# EAGLE design lamloei_node32s3wroom_ft231xq_main_2layers (EAGLE 7.7.0)
CNAME: LamLoei Node32S3Wroom; CREVISION: R1; DESIGNER: lamloei co.,ltd.
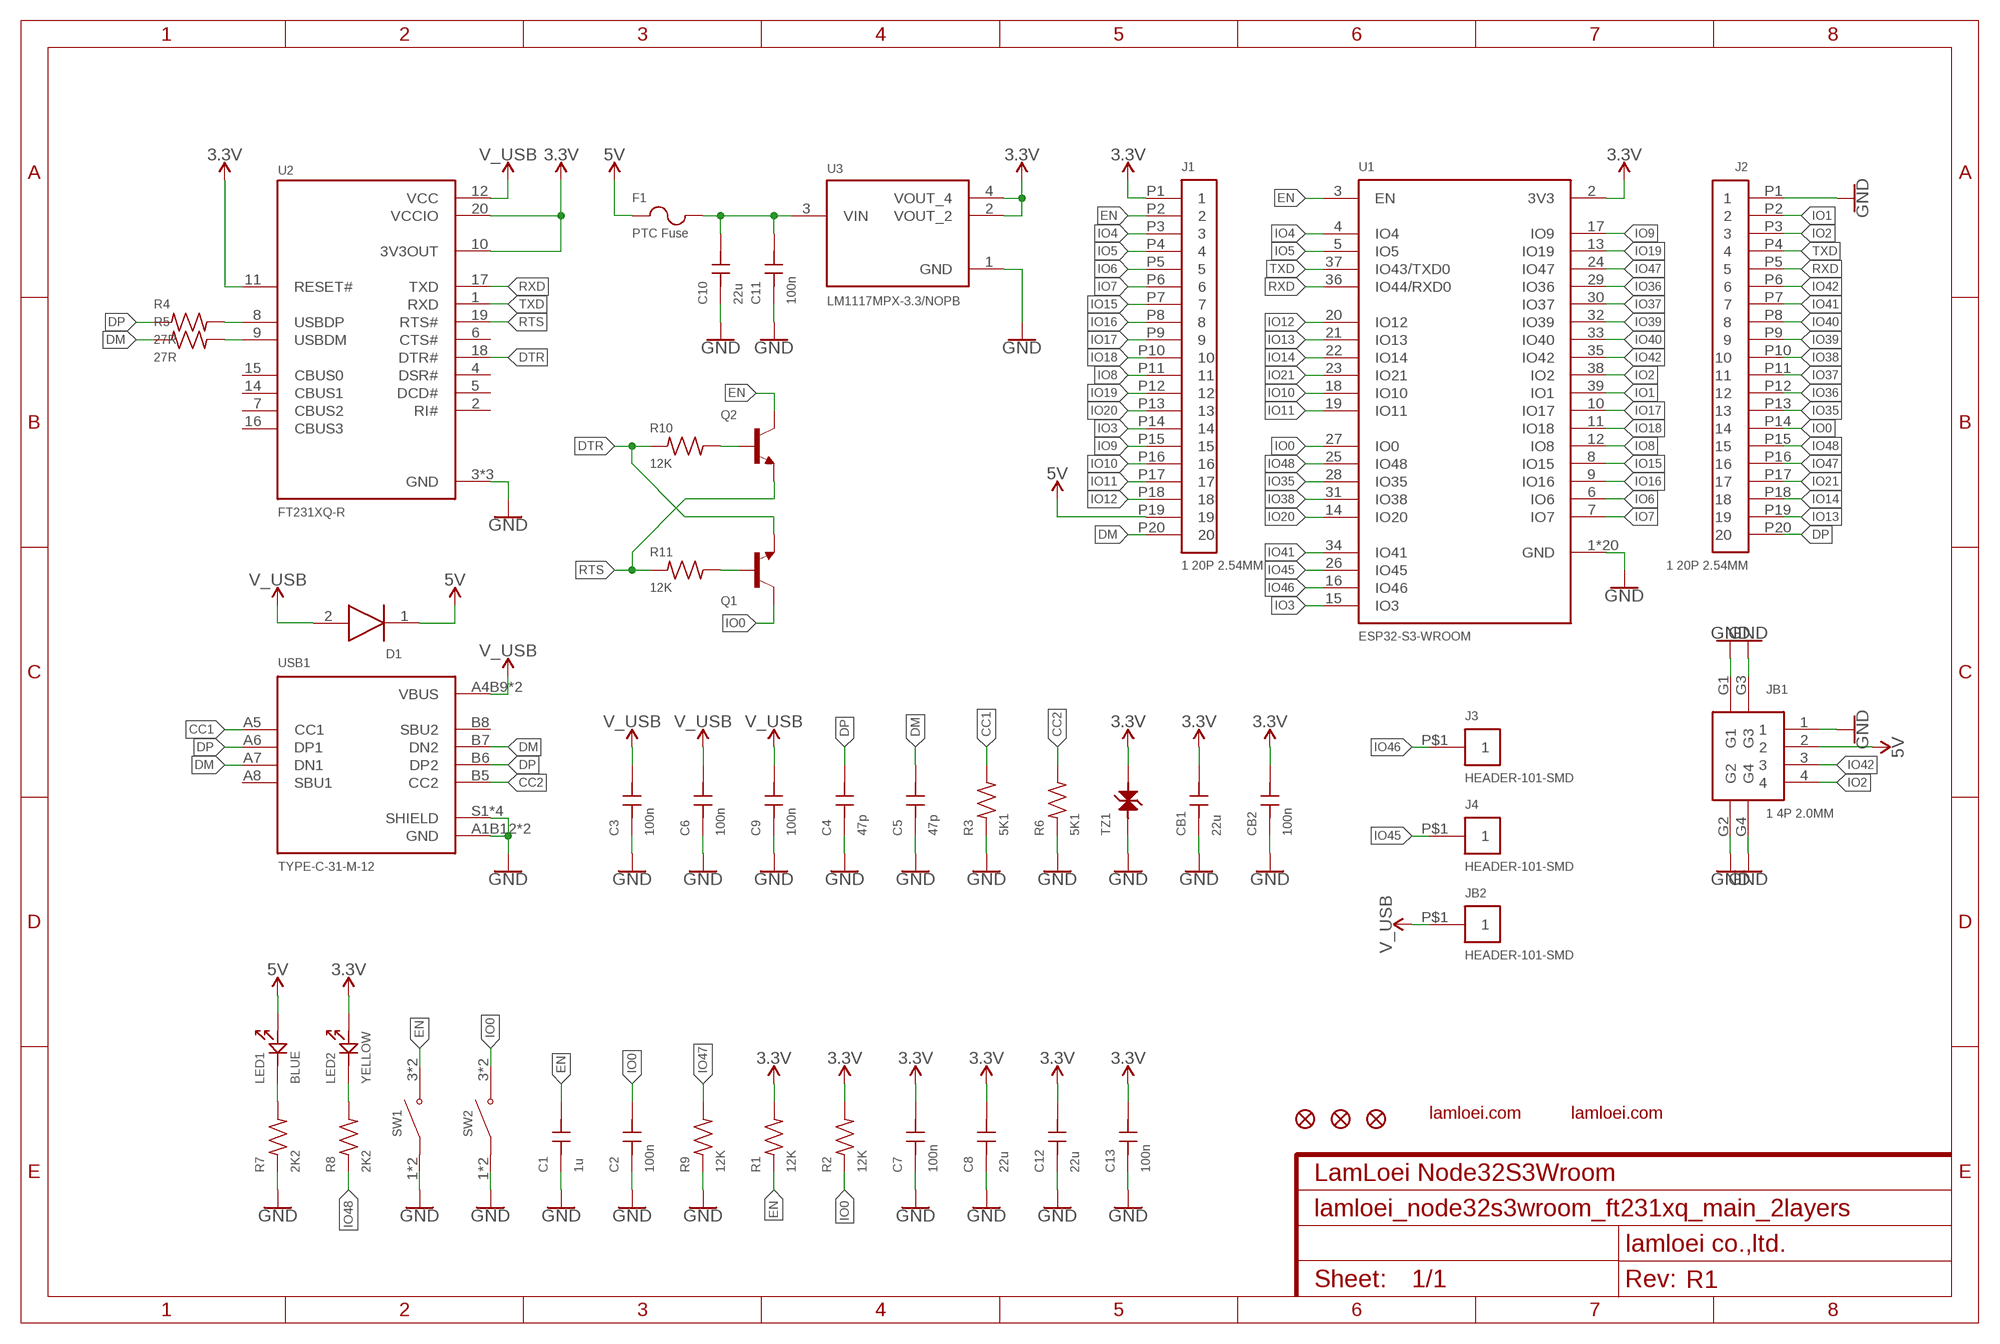
[diagram p0: schematic, sheet 1]

## Parts
C1  1u  GRM155R70J105KA12D  [GRM155R70J105KA12D]
C2  100n  GCM155R71H104KE02D  [GCM155R71H104KE02D]
C3  100n  GCM155R71H104KE02D  [GCM155R71H104KE02D]
C4  47p  GCM1555C1H470JA16D  [GCM1555C1H470JA16D]
C5  47p  GCM1555C1H470JA16D  [GCM1555C1H470JA16D]
C6  100n  GCM155R71H104KE02D  [GCM155R71H104KE02D]
C7  100n  GCM155R71H104KE02D  [GCM155R71H104KE02D]
C8  22u  GCM21BR71H105KA03L  [GCM21BR71H105KA03L]
C9  100n  GCM155R71H104KE02D  [GCM155R71H104KE02D]
C10  22u  GCM21BR71H105KA03L  [GCM21BR71H105KA03L]
C11  100n  GCM155R71H104KE02D  [GCM155R71H104KE02D]
C12  22u  GCM21BR71H105KA03L  [GCM21BR71H105KA03L]
C13  100n  GCM155R71H104KE02D  [GCM155R71H104KE02D]
CB1  22u  GCM21BR71H105KA03L  [GCM21BR71H105KA03L]
CB2  100n  GCM155R71H104KE02D  [GCM155R71H104KE02D]
D1  PMEG4050EP,115  [PMEG4050EP,115]
F1  PTC Fuse  MF-NSMF050-2  [MF-NSMF050-2]
J1  1 20P 2.54MM  HEADER-120  [HEADER-120]
J2  1 20P 2.54MM  HEADER-120  [HEADER-120]
J3  HEADER-101-SMD  [HEADER-101-SMD]
J4  HEADER-101-SMD  [HEADER-101-SMD]
JB1  1 4P 2.0MM  A2012WR-S-4P  [A2012WR-S-4P]
JB2  HEADER-101-SMD  [HEADER-101-SMD]
LED1  BLUE  19-217BHC-ZL1M2RY3T  [19-217BHC-ZL1M2RY3T]
LED2  YELLOW  19-213/Y2C-CQ2R2L/3T(CY)  [19-213/Y2C-CQ2R2L/3T(CY)]
Q1  BC847B,215  [BC847B,215]
Q2  BC847B,215  [BC847B,215]
R1  12K  RC0402FR-0712KL  [R0402]
R2  12K  RC0402FR-0712KL  [R0402]
R3  5K1  RC0402FR-075K1L  [R0402]
R4  27R  RC0402FR-0727RL  [R0402]
R5  27R  RC0402FR-0727RL  [R0402]
R6  5K1  RC0402FR-075K1L  [R0402]
R7  2K2  RC0402FR-072K2L  [R0402]
R8  2K2  RC0402FR-072K2L  [R0402]
R9  12K  RC0402FR-0712KL  [R0402]
R10  12K  RC0402FR-0712KL  [R0402]
R11  12K  RC0402FR-0712KL  [R0402]
SW1  K2-1808SN-A4SW-01  [K2-1808SN-A4SW-01]
SW2  K2-1808SN-A4SW-01  [K2-1808SN-A4SW-01]
TZ1  LXES15AAA1-153  [LXES15AAA1-153]
U1  ESP32-S3-WROOM  [ESP32-S3-WROOM]
U2  FT231XQ-R  [FT231XQ-R]
U3  LM1117MPX-3.3/NOPB  [LM1117MPX-3.3/NOPB]
USB1  TYPE-C-31-M-12  [TYPE-C-31-M-12]
ZFD1  FIDUCIAL1X2  [FIDUCIAL-1X2]
ZFD2  FIDUCIAL1X2  [FIDUCIAL-1X2]
ZFD3  FIDUCIAL1X2  [FIDUCIAL-1X2]
ZL1  LAMLEOI_LOGO_3  [LAMLEOI_LOGO_3]
ZL2  LAMLEOI_LOGO_3  [LAMLEOI_LOGO_3]

## Nets
3.3V: C7.2 C8.2 C12.2 C13.2 CB1.2 CB2.2 J1.P1 LED2.2 R1.2 R2.2 TZ1.2 U1.2(3V3) U2.10(3V3OUT) U2.11(RESET#) U2.20(VCCIO) U3.2(VOUT_2) U3.4(VOUT_4)
5V: D1.1(K) F1.1 J1.P19 JB1.2 LED1.2
CC1: R3.2 USB1.A5(CC1)
CC2: R6.2 USB1.B5(CC2)
DM: C5.2 J1.P20 R5.1 USB1.A7(DN1) USB1.B7(DN2)
DP: C4.2 J2.P20 R4.1 USB1.A6(DP1) USB1.B6(DP2)
DTR: Q1.E R10.1 U2.18(DTR#)
EN: C1.2 J1.P2 Q2.C R1.1 SW1.3(NO) SW1.4(NO) U1.3(EN)
GND: C1.1 C2.1 C3.1 C4.1 C5.1 C6.1 C7.1 C8.1 C9.1 C10.1 C11.1 C12.1 C13.1 CB1.1 CB2.1 J2.P1 JB1.1 JB1.G1 JB1.G2 JB1.G3 JB1.G4 R3.1 R6.1 R7.1 R9.1 SW1.1(COM) SW1.2(COM) SW2.1(COM) SW2.2(COM) TZ1.1 U1.1(GND) U1.1.1(GND) U1.1.2(GND) U1.1.3(GND) U1.1.4(GND) U1.1.5(GND) U1.1.6(GND) U1.1.7(GND) U1.1.8(GND) U1.1.9(GND) U1.1.10(GND) U1.1.11(GND) U1.1.12(GND) U1.1.13(GND) U1.1.14(GND) U1.1.15(GND) U1.1.16(GND) U1.1.17(GND) U1.1.18(GND) U1.40(GND) U2.3(GND) U2.13(GND) U2.21(GND) U3.1(GND) USB1.A1B12(GND) USB1.B1A12(GND) USB1.S1(SHIELD) USB1.S2(SHIELD) USB1.S3(SHIELD) USB1.S4(SHIELD)
IO0: C2.2 J2.P14 Q1.C R2.1 SW2.3(NO) SW2.4(NO) U1.27(IO0)
IO1: J2.P2 U1.39(IO1)
IO2: J2.P3 JB1.4 U1.38(IO2)
IO3: J1.P14 U1.15(IO3)
IO4: J1.P3 U1.4(IO4)
IO5: J1.P4 U1.5(IO5)
IO6: J1.P5 U1.6(IO6)
IO7: J1.P6 U1.7(IO7)
IO8: J1.P11 U1.12(IO8)
IO9: J1.P15 U1.17(IO9)
IO10: J1.P16 U1.18(IO10)
IO11: J1.P17 U1.19(IO11)
IO12: J1.P18 U1.20(IO12)
IO13: J2.P19 U1.21(IO13)
IO14: J2.P18 U1.22(IO14)
IO15: J1.P7 U1.8(IO15)
IO16: J1.P8 U1.9(IO16)
IO17: J1.P9 U1.10(IO17)
IO18: J1.P10 U1.11(IO18)
IO19: J1.P12 U1.13(IO19)
IO20: J1.P13 U1.14(IO20)
IO21: J2.P17 U1.23(IO21)
IO35: J2.P13 U1.28(IO35)
IO36: J2.P12 U1.29(IO36)
IO37: J2.P11 U1.30(IO37)
IO38: J2.P10 U1.31(IO38)
IO39: J2.P9 U1.32(IO39)
IO40: J2.P8 U1.33(IO40)
IO41: J2.P7 U1.34(IO41)
IO42: J2.P6 JB1.3 U1.35(IO42)
IO45: J4.P$1 U1.26(IO45)
IO46: J3.P$1 U1.16(IO46)
IO47: J2.P16 R9.2 U1.24(IO47)
IO48: J2.P15 R8.1 U1.25(IO48)
N$1: R4.2 U2.8(USBDP)
N$2: R5.2 U2.9(USBDM)
N$3: C10.2 C11.2 F1.2 U3.3(VIN)
N$4: LED1.1 R7.2
N$5: LED2.1 R8.2
N$6: Q2.B R10.2
N$7: Q1.B R11.2
RTS: Q2.E R11.1 U2.19(RTS#)
RXD: J2.P5 U1.36(IO44/RXD0) U2.17(TXD)
TXD: J2.P4 U1.37(IO43/TXD0) U2.1(RXD)
V_USB: C3.2 C6.2 C9.2 D1.2(A) JB2.P$1 U2.12(VCC) USB1.A4B9(VBUS) USB1.B4A9(VBUS)
Unconnected: U2.2(RI#) U2.4(DSR#) U2.5(DCD#) U2.6(CTS#) U2.7(CBUS2) U2.14(CBUS1) U2.15(CBUS0) U2.16(CBUS3) USB1.A8(SBU1) USB1.B8(SBU2)

## Library data of the parts
C1 = lamloei_e77_GRM155R70J105KA12D:GRM155R70J105KA12D; MANUFACTURER_PART_NUMBER: GRM155R70J105KA12D; VENDOR: Murata
C2 C3 C6 C7 C9 C11 C13 CB2 = lamloei_e77_GCM155R71H104KE02D:GCM155R71H104KE02D; MANUFACTURER_PART_NUMBER: GCM155R71H104KE02D; VENDOR: Murata
C4 C5 = lamloei_e77_GCM1555C1H470JA16D:GCM1555C1H470JA16D; MANUFACTURER_PART_NUMBER: GCM1555C1H470JA16D; VENDOR: Murata
C8 C10 C12 CB1 = lamloei_e77_GCM21BR71H105KA03L:GCM21BR71H105KA03L; MANUFACTURER_PART_NUMBER: GCM21BR71H105KA03L; VENDOR: Murata
D1 = lamloei_e77_PMEG4050EP_115:PMEG4050EP,115: Nexperia PMEG4050EP,115 SMT Schottky Diode, 40V 5A, 2-Pin SOD-128 Source: Datasheet <http://uk.rs-online.com/web/p/products/7805405P>; DESCRIPTION: Nexperia PMEG4050EP,115 SMT Schottky Diode, 40V 5A, 2-Pin SOD-128; HEIGHT: 1.1mm; MANUFACTURER_NAME: Nexperia; MANUFACTURER_PART_NUMBER: PMEG4050EP,115; RS_PART_NUMBER: 7805405P; RS_PRICE-STOCK: http://uk.rs-online.com/web/p/products/7805405P
F1 = lamloei_e77_mf-nsmf050-2:MF-NSMF050-2; DATASHEET: https://datasheet.lcsc.com/lcsc/1809212037_BOURNS-MF-NSMF050-2_C75464.pdf; DESCRIPTIONS: 13.2V 1A 1206 PTC Resettable Fuses; LCSC_PART: C75464; MANUFACTURER: BOURNS; MANUFACTURER_PART_NUMBER: MF-NSMF050-2; OPERATION_TEMPERATURE: -40°C ~ +85°C; OPERATION_TEMPERATURE_HIGH: +85°C; OPERATION_TEMPERATURE_LOW: -40°C; PACKAGE: 1206; PCBA_COST: Extended
J1 = lamloei_e77_HEADER-120A:HEADER-120
J2 = lamloei_e77_HEADER-120B:HEADER-120
J3 J4 JB2 = lamloei_e77_HEADER-101-SMD:HEADER-101-SMD
JB1 = lamloei_e77_a2012wr-s-4p:A2012WR-S-4P
LED1 = lamloei_e77_19-217BHC-ZL1M2RY3T:19-217BHC-ZL1M2RY3T; MANUFACTURER_PART_NUMBER: 19-217BHC-ZL1M2RY3T; VENDOR: Everlight Elec
LED2 = lamloei_e77_19-213Y2C-CQ2R2L3T(CY):19-213/Y2C-CQ2R2L/3T(CY); MANUFACTURER_PART_NUMBER: 19-213/Y2C-CQ2R2L/3T(CY); VENDOR: Everlight Elec
Q1 Q2 = lamloei_e77_bc847b_215:BC847B,215; AVAILABILITY: In Stock; DESCRIPTION: Bipolar (BJT) Transistor NPN 45V 100mA 100MHz 300mW Surface Mount SOT-23-3 (TO-236); MF: ON Semiconductor; MP: BC847BLT3G; PACKAGE: SOT-23-3 ON Semiconductor; PRICE: None
R1 R2 R9-R11 = lamloei_e77_rc0402fr-0712kl:RC0402FR-0712KL; DATASHEET: https://datasheet.lcsc.com/lcsc/1811081726_YAGEO-RC0402FR-0712KL_C114760.pdf; DESCRIPTIONS: 12kΩ ±1% 0.0625W ±100ppm/°C; DIELECTRIC: X7R; LCSC_PART: C114760; MANUFACTURER: YAGEO; MANUFACTURER_PART_NUMBER: RC0402FR-0712KL; OPERATION_POWER: 1/16W; OPERATION_TEMPERATURE: -55°C ~ +155°C; OPERATION_TEMPERATURE_HIGH: +155°C; OPERATION_TEMPERATURE_LOW: -55°C; PACKAGE: 0402; PCBA_COST: EXTENDED; RATED_VOLTAGE: 100VDC; RESISTANCE: 12kΩ; TOLERANCE: ±1%
R3 R6 = lamloei_e77_rc0402fr-075k1l:RC0402FR-075K1L; DATASHEET: https://datasheet.lcsc.com/lcsc/1809201112_YAGEO-RC0402FR-075K1L_C105872.pdf; DESCRIPTIONS: 5.1kΩ ±1% 0.0625W ±100ppm/°C; DIELECTRIC: X7R; LCSC_PART: C105872; MANUFACTURER: YAGEO; MANUFACTURER_PART_NUMBER: RC0402FR-075K1L; OPERATION_POWER: 1/16W; OPERATION_TEMPERATURE: -55°C ~ +155°C; OPERATION_TEMPERATURE_HIGH: +155°C; OPERATION_TEMPERATURE_LOW: -55°C; PACKAGE: 0402; PCBA_COST: EXTENDED; RATED_VOLTAGE: 100VDC; RESISTANCE: 5.1kΩ; TOLERANCE: ±1%
R4 R5 = lamloei_e77_rc0402fr-0727rl:RC0402FR-0727RL; DATASHEET: https://datasheet.lcsc.com/lcsc/1810241334_YAGEO-RC0402FR-0727RL_C138021.pdf; DESCRIPTIONS: 27Ω ±1% 0.0625W ±100ppm/°C; DIELECTRIC: X7R; LCSC_PART: C138021; MANUFACTURER: YAGEO; MANUFACTURER_PART_NUMBER: RC0402FR-0727RL; OPERATION_POWER: 1/16W; OPERATION_TEMPERATURE: -55°C ~ +155°C; OPERATION_TEMPERATURE_HIGH: +155°C; OPERATION_TEMPERATURE_LOW: -55°C; PACKAGE: 0402; PCBA_COST: EXTENDED; RATED_VOLTAGE: 100VDC; RESISTANCE: 27Ω; TOLERANCE: ±1%
R7 R8 = lamloei_e77_rc0402fr-072k2l:RC0402FR-072K2L; DATASHEET: https://datasheet.lcsc.com/lcsc/1809201112_YAGEO-RC0402FR-072K2L_C114762.pdf; DESCRIPTIONS: 2.2kΩ ±1% 0.0625W ±100ppm/°C; DIELECTRIC: X7R; LCSC_PART: C114762; MANUFACTURER: YAGEO; MANUFACTURER_PART_NUMBER: RC0402FR-072K2L; OPERATION_POWER: 1/16W; OPERATION_TEMPERATURE: -55°C ~ +155°C; OPERATION_TEMPERATURE_HIGH: +155°C; OPERATION_TEMPERATURE_LOW: -55°C; PACKAGE: 0402; PCBA_COST: EXTENDED; RATED_VOLTAGE: 100VDC; RESISTANCE: 2.2kΩ; TOLERANCE: ±1%
SW1 SW2 = lamloei_e77_K2-1808SN-A4SW-01:K2-1808SN-A4SW-01: Check prices <https://pricing.snapeda.com/parts/4-1437565-2/TE%20Connectivity/view-part?ref=eda>; AVAILABILITY: In Stock; COMMENT: 4-1437565-2; CONFIGURATION_POLE-THROW: Single Pole - Single Throw; CONTACT_CURRENT_RATING: 50 mA; DESCRIPTION: Tactile Switch SPST-NO Top Actuated Surface Mount; EU_ROHS_COMPLIANCE: Compliant; MF: TE Connectivity; MP: 4-1437565-2; PACKAGE: None; PRICE: None
TZ1 = lamloei_e77_lxes15aaa1-153:LXES15AAA1-153; DATASHEET: https://datasheet.lcsc.com/lcsc/1811081617_Murata-Electronics-LXES15AAA1-153_C86141.pdf; DESCRIPTIONS: Bidirectional 4V 0402 Diodes - ESD; LCSC_PART: C86141; MANUFACTURER: Murata; MANUFACTURER_PART_NUMBER: LXES15AAA1-153; OPERATION_TEMPERATURE: -40°C ~ +85°C; OPERATION_TEMPERATURE_HIGH: +85°C; OPERATION_TEMPERATURE_LOW: -40°C; PACKAGE: 0402; PCBA_COST: EXTENDED; RATED_VOLTAGE: 4V
U1 = lamloei_e77_ESP32-S3-WROOM-ANT:ESP32-S3-WROOM: Module: combo; GPIO, I2C x2, I2S x2, SDIO, SPI x3, UART x3; 19.5dBm; AVAILABILITY: Warning; DESCRIPTION: Module: combo; GPIO, I2C x2, I2S x2, SDIO, SPI x3, UART x3; 19.5dBm; MF: Olimex LTD; MP: ESP-WROOM-32; PACKAGE: Module Espressif Systems; PRICE: 4.57 USD
U2 = lamloei_e77_FT231XQ-R:FT231XQ-R: USB2.0 Full Speed IC offers a compact bridge to full handshake UART Interface Check prices <https://pricing.snapeda.com/parts/FT231XQ-R/FTDI%2C%20Future/view-part?ref=eda>; AVAILABILITY: In Stock; DESCRIPTION: USB Bridge, USB to UART USB 2.0 UART Interface 20-QFN (4x4); MF: FTDI, Future; MP: FT231XQ-R; PACKAGE: QFN-20 FTDI; PRICE: None; PURCHASE-URL: https://pricing.snapeda.com/search/part/FT231XQ-R/?ref=eda
U3 = lamloei_e77_LM1117MPX-3.3_NOPB:LM1117MPX-3.3/NOPB: 800-mA 15-V linear voltage regulator 4-SOT-223 0 to 125 Check prices <https://pricing.snapeda.com/parts/LM1117MPX-3.3/NOPB/Texas%20Instruments/view-part?ref=eda>; AVAILABILITY: In Stock; DESCRIPTION: 800-mA 15-V linear voltage regulator 4-SOT-223 0 to 125; MF: Texas Instruments; MP: LM1117MPX-3.3/NOPB; PACKAGE: SOT-223-4 Texas Instruments; PRICE: None; PURCHASE-URL: https://pricing.snapeda.com/search/part/LM1117MPX-3.3/NOPB/?ref=eda
USB1 = _lamloei_e77_TYPE-C-31-M-12:TYPE-C-31-M-12; AVAILABILITY: Unavailable; DESCRIPTION: USB Connectors 24 Receptacle 1 8.94*7.3mm RoHS; DIFFX: 1.75; DIFFY: -3.53; MF: HRO Electronics Co., Ltd.; MP: TYPE-C-31-M-12; PACKAGE: Package; PRICE: None
ZFD1-ZFD3 = SparkFun-Aesthetics:FIDUCIAL: Fiducial Alignment Points Point-of-reference for pick-and-place machines and other optical instruments.
ZL1 ZL2 = lamloei_logo_3:LAMLEOI_LOGO_3: lamloei

## Board
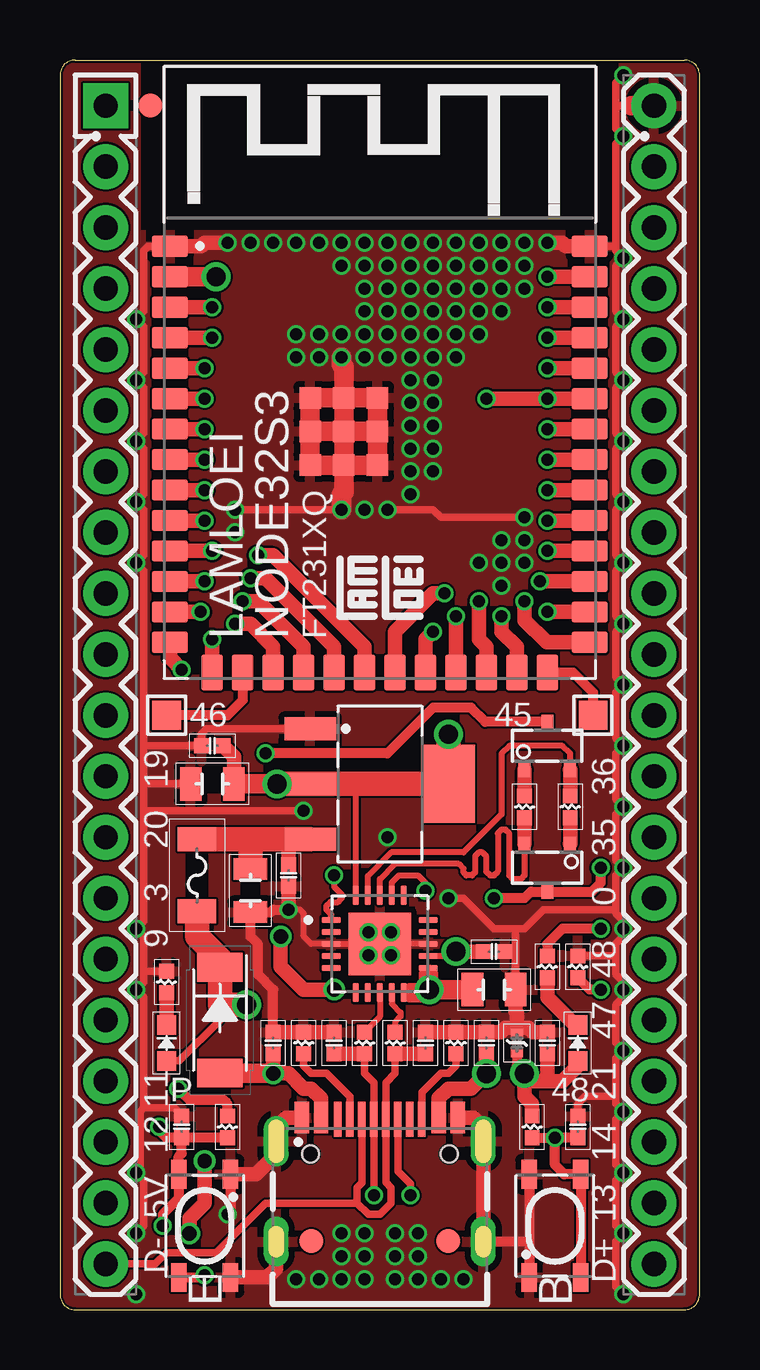
[diagram p1: board, top side]
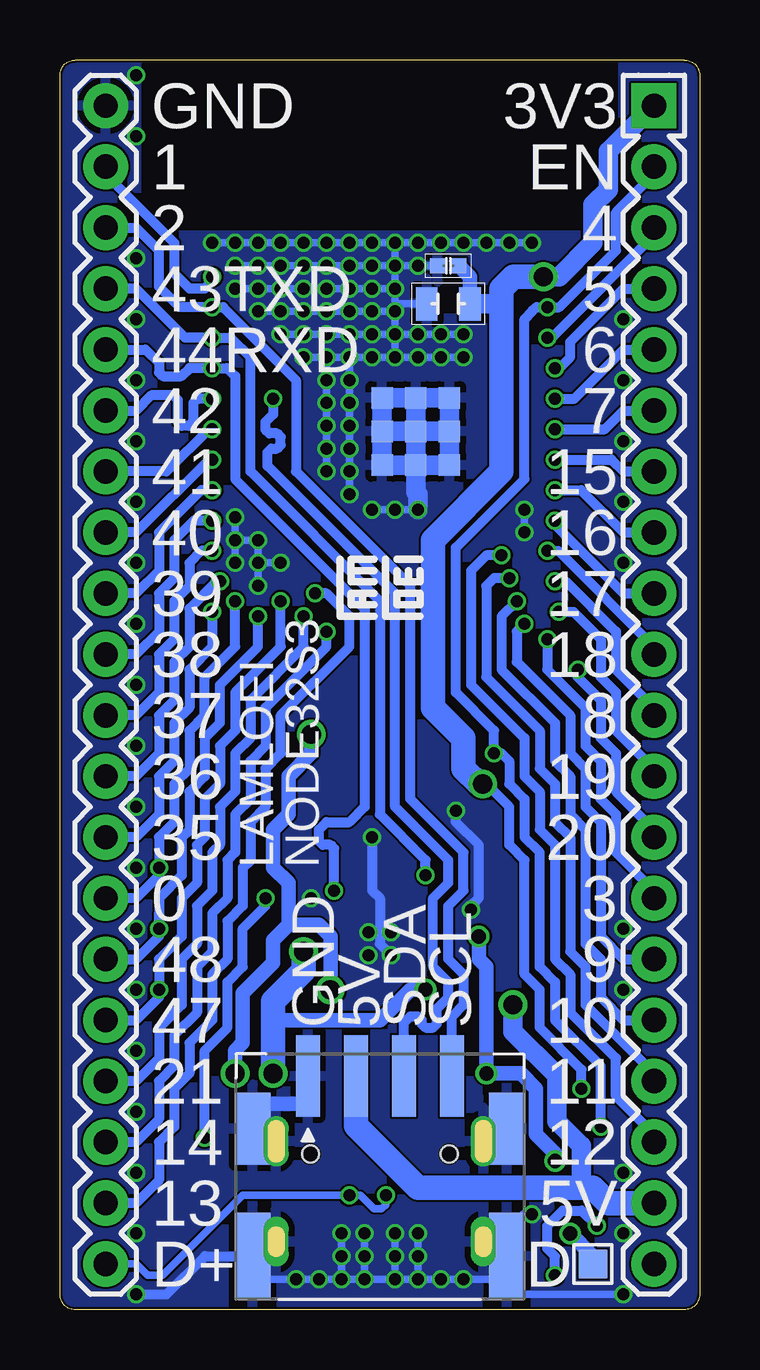
[diagram p2: board, bottom side, seen from below]

Size 26.67 x 52.07 mm. Coordinates in mm from the lower left corner, seen from the top.
Outline: 26.04,0 arc90 26.67,0.64 26.67,51.44 arc90 26.04,52.07 0.64,52.07 arc90 0,51.44 0,0.64 arc90 0.64,0 26.04,0
Copper layers (1*16): Top 0.035mm / dielectric 0.2mm / Bottom 0.035mm
Design rules "jlcpcb-2-layer": minimum track width 3.5mil, minimum drill 0.2mm, track to track 3.5mil, track to pad 5mil, pad to pad 5mil, via to via 5mil, smd to smd 0mil, copper to edge 0.1mm, drill to drill 5mil, minimum pad ring 4mil, minimum via ring 4mil, stop-mask expansion 3mil, vias tented up to drill 100mil, thermal gap 10mil

### Footprints (pad centres in the part's own frame; a part is rotated, then mirrored left to right if it is on the bottom)
GRM155R70J105KA12D = smd 0.62 x 0.62: 1 -0.45,0; 2 0.45,0
GCM155R71H104KE02D = smd 0.62 x 0.62: 1 -0.45,0; 2 0.45,0
GCM1555C1H470JA16D = smd 0.62 x 0.62: 1 -0.45,0; 2 0.45,0
GCM21BR71H105KA03L = smd 0.9 x 1.4: 1 -0.9,0; 2 0.9,0
PMEG4050EP,115 = smd 1.2 x 1.9: 1 -2.2,0; 2 2.2,0
MF-NSMF050-2 = smd 1 x 1.6: 1 -1.5,0; 2 1.5,0
HEADER-120 = drill 1.016 pad 1.88 square: P1 24.13,0 | drill 1.016 pad 1.88: P2 21.59,0; P3 19.05,0; P4 16.51,0; P5 13.97,0; P6 11.43,0; P7 8.89,0; P8 6.35,0; P9 3.81,0; P10 1.27,0; P11 -1.27,0; P12 -3.81,0; P13 -6.35,0; P14 -8.89,0; P15 -11.43,0; P16 -13.97,0; P17 -16.51,0; P18 -19.05,0; P19 -21.59,0; P20 -24.13,0
HEADER-120' = drill 1.016 pad 1.88: P1 24.13,0; P2 21.59,0; P3 19.05,0; P4 16.51,0; P5 13.97,0; P6 11.43,0; P7 8.89,0; P8 6.35,0; P9 3.81,0; P10 1.27,0; P11 -1.27,0; P12 -3.81,0; P13 -6.35,0; P14 -8.89,0; P15 -11.43,0; P16 -13.97,0; P17 -16.51,0; P18 -19.05,0; P19 -21.59,0; P20 -24.13,0
HEADER-101-SMD = smd 1.2 x 1.2: P$1 0,0
A2012WR-S-4P = smd 1 x 3.4: 1 -3,3.7; 2 -1,3.7; 3 1,3.7; 4 3,3.7 | smd 1.5 x 3.6: G1 -5.3,-3.8; G2 5.3,-3.8 | smd 1.5 x 3: G3 -5.3,1.5; G4 5.3,1.5
19-217BHC-ZL1M2RY3T = smd 0.8 x 0.8: 1 -0.75,0; 2 0.75,0
19-213/Y2C-CQ2R2L/3T(CY) = smd 0.8 x 0.8: 1 -0.75,0; 2 0.75,0
BC847B,215 = smd 0.6 x 0.5: B 1,-0.95; C -1,0; E 1,0.95
R0402 = smd 0.62 x 0.62: 1 -0.45,0; 2 0.45,0
K2-1808SN-A4SW-01 = smd 1.2 x 0.65: 1 -2.15,1.075; 2 2.15,1.075; 3 -2.15,-1.075; 4 2.15,-1.075
LXES15AAA1-153 = smd 0.4 x 0.5: 1 -0.4,0; 2 0.4,0
ESP32-S3-WROOM = smd 0.9 x 1.5: 1 -5.26,-8.75; 2 -3.99,-8.75; 3 -2.72,-8.75; 4 -1.45,-8.75; 5 -0.18,-8.75; 6 1.09,-8.75; 7 2.36,-8.75; 8 3.63,-8.75; 9 4.9,-8.75; 10 6.17,-8.75; 11 7.44,-8.75; 12 8.71,-8.75; 13 9.98,-8.75; 14 11.25,-8.75; 27 11.25,8.75; 28 9.98,8.75; 29 8.71,8.75; 30 7.44,8.75; 31 6.17,8.75; 32 4.9,8.75; 33 3.63,8.75; 34 2.36,8.75; 35 1.09,8.75; 36 -0.18,8.75; 37 -1.45,8.75; 38 -2.72,8.75; 39 -3.99,8.75; 40 -5.26,8.75 | smd 0.9 x 0.9: 1.1 1.06,-2.9; 1.2 1.06,-1.5; 1.3 1.06,-0.1; 1.4 2.46,-2.9; 1.5 2.46,-1.5; 1.6 2.46,-0.1; 1.7 3.86,-2.9; 1.8 3.86,-1.5; 1.9 3.86,-0.1 | smd 0.9 x 0.9 bottom: 1.10 1.06,-2.9; 1.11 1.06,-1.5; 1.12 1.06,-0.1; 1.13 2.46,-2.9; 1.14 2.46,-1.5; 1.15 2.46,-0.1; 1.16 3.86,-2.9; 1.17 3.86,-1.5; 1.18 3.86,-0.1 | smd 1.5 x 0.9: 15 12.5,-6.985; 16 12.5,-5.715; 17 12.5,-4.445; 18 12.5,-3.175; 19 12.5,-1.905; 20 12.5,-0.635; 21 12.5,0.635; 22 12.5,1.905; 23 12.5,3.175; 24 12.5,4.445; 25 12.5,5.715; 26 12.5,6.985
FT231XQ-R = smd 0.25 x 0.8: 1 -1,-2.025; 2 -0.5,-2.025; 3 0,-2.025; 4 0.5,-2.025; 5 1,-2.025; 11 1,2.025; 12 0.5,2.025; 13 0,2.025; 14 -0.5,2.025; 15 -1,2.025 | smd 0.8 x 0.25: 6 2.025,-1; 7 2.025,-0.5; 8 2.025,0; 9 2.025,0.5; 10 2.025,1; 16 -2.025,1; 17 -2.025,0.5; 18 -2.025,0; 19 -2.025,-0.5; 20 -2.025,-1 | smd 2.6 x 2.6: 21 0,0
LM1117MPX-3.3/NOPB = smd 2.15 x 0.95: 1 2.9,-2.3; 2 2.9,0; 3 2.9,2.3 | smd 2.15 x 3.25: 4 -2.9,0
TYPE-C-31-M-12 = smd 0.6 x 1.3: A1B12 3.25,-3.56; A4B9 2.45,-3.56; B1A12 -3.25,-3.56; B4A9 -2.45,-3.56 | smd 0.3 x 1.45: A5 1.25,-3.485; A6 0.25,-3.485; A7 -0.25,-3.485; A8 -1.25,-3.485; B5 -1.75,-3.485; B6 -0.75,-3.485; B7 0.75,-3.485; B8 1.75,-3.485 | drill 0.65 pad 1.05 long: S1 4.32,-2.57; S2 -4.32,-2.57; S3 4.32,1.61; S4 -4.32,1.61 | hole 0.7: 2.89,-2.04; -2.89,-2.04
FIDUCIAL-1X2 = smd 1 x 1: 1 0,0

### Placement (x,y rotation side)
C1  5.08,7.62 270 top
C2  21.59,7.62 270 top
C3  8.89,11.11 270 top
C4  11.43,11.11 270 top
C5  15.24,11.11 270 top
C6  17.78,11.11 270 top
C7  20.32,11.11 270 top
C8  18.1,13.34 180 top
C9  18.1,14.92 180 top
C10  7.94,17.46 90 top
C11  9.53,18.1 90 top
C12  6.35,21.91 0 top
C13  6.35,23.5 0 top
CB1  10.48,41.91 0 bottom
CB2  10.48,43.5 0 bottom
D1  6.67,12.06 270 top
F1  5.71,18.1 90 top
J1  1.91,26.04 90 top
J2  1 20P 2.54MM  [HEADER-120']  24.77,26.04 90 top
J3  4.45,24.77 0 top
J4  22.23,24.77 0 top
JB1  13.34,6.03 0 bottom
JB2  4.45,1.91 0 bottom
LED1  4.45,11.11 270 top
LED2  21.59,11.11 270 top
Q1  20.32,18.41 90 top
Q2  20.32,23.5 270 top
R1  6.99,7.62 90 top
R2  19.68,7.62 90 top
R3  10.16,11.11 270 top
R4  12.7,11.11 90 top
R5  13.97,11.11 90 top
R6  16.51,11.11 270 top
R7  4.45,13.65 270 top
R8  20.32,14.29 270 top
R9  21.59,14.29 270 top
R10  19.37,20.95 90 top
R11  21.27,20.95 270 top
SW1  6.03,3.49 270 top
SW2  20.64,3.49 90 top
TZ1  19.05,11.11 270 top
U1  13.34,39.05 270 top
U2  13.34,15.24 270 top
U3  13.34,21.91 180 top
USB1  13.34,4.45 180 top
ZFD1  3.77,50.16 0 top
ZFD2  10.48,2.86 0 top
ZFD3  16.19,2.86 0 top
ZL1  11.35,28.57 0 top
ZL2  15.32,28.57 0 bottom

### Tracks (layer width: path | path; a pad name or v marks a point on that pad's centre or on a via)
3.3V  (via drill 0.5, 0.8)
  Top 0.254: U2.10 14.61,13.21 | U2.11 15.36,13.97 | U2.20 12.34,21.91 12.38,21.91
  Top 0.406: TZ1.2 19.05,10.16 v19.37,9.84 | R1.2 6.99,8.57 6.83,8.73 5.4,8.73 v4.92,9.21
  Top 0.61: 16.83,13.34 C8.2 | R2.2 19.68,8.57 19.37,8.89 v19.37,9.84 19.37,9.53 20.32,9.53 | LED2.2 21.59,10.16 20.95,9.53 20.32,9.53 | C7.2 20.32,9.53 | C12.2 7.25,23.05 C13.2
  Top 0.813: 15.36,13.97 15.36,13.34 v15.4,13.34 | v15.4,13.34 16.83,13.34 | U1.2 v6.51,43.04 | C12.2 v9.05,21.91 | 14.61,13.21 15.28,13.21 v15.4,13.34
  Top 1.016: v16.19,23.97 16.19,21.91 U3.4 12.38,21.91 U3.2 v9.05,21.91
  Bottom 0.406: v4.92,9.21 4.92,10 6.67,11.75 6.67,13.34 7.3,13.97 7.3,18.73 7.94,19.37 7.94,20.95 8.89,21.91 v9.05,21.91
  Bottom 0.61: v15.4,13.34 15.4,15.56 15.88,16.03 17.14,16.03 | 17.14,16.03 17.78,15.4 17.78,14.45 19.05,13.18 19.05,11.11 19.37,10.79 v19.37,9.84 | 17.14,16.03 17.14,17.78 17.78,18.41 17.78,20 17.14,20.64 17.14,22.23 16.19,23.18 v16.19,23.97 | CB1.2 9.58,43.05 CB2.2
  Bottom 0.813: v6.51,43.04 5.85,43.04 4.45,44.45 4.45,46.04 3.81,46.67 3.81,48.26 J1.P1 | CB1.2 8.26,41.91
  Bottom 1.016: v6.51,43.04 7.76,43.04 8.26,42.55 8.26,41.91 8.26,34.92 11.11,32.07 11.11,25.08 9.84,23.81 9.84,22.54 9.21,21.91 v9.05,21.91
5V  (via drill 0.8)
  Top 0.305: LED1.2 4.96,10.36 6.67,12.06 6.67,12.7
  Top 1.016: F1.1 5.71,15.56 6.67,14.61 D1.1 6.67,12.7 v7.78,12.7
  Bottom 0.813: v7.78,12.7 7.78,11.59 5.95,9.76 5.95,7.86 4.92,6.83 4.92,5.08
  Bottom 1.016: J1.P19 3.81,4.45 4.45,5.08 4.92,5.08 11.75,5.08 14.34,7.67 JB1.2
CC1
  Top 0.305: USB1.A5 12.09,8.87 11.11,9.84 10.48,9.84 10.16,10.16 R3.2
CC2
  Top 0.305: USB1.B5 15.09,9.05 15.88,9.84 16.19,9.84 16.51,10.16 R6.2
DM
  Top 0.305: R5.1 13.97,9.84 13.59,9.46 USB1.A7 13.59,5.31 13.81,5.08 13.81,4.45 13.34,3.97 12.86,3.97 12.38,4.45 | J1.P20 3.97,1.91 4.45,2.38 6.51,2.38 8.57,4.45 12.38,4.45 | USB1.B7 12.59,5.28 12.38,5.08 12.38,4.45
  Top 0.61: R5.1 C5.2
DP  (via drill 0.5)
  Top 0.305: R4.1 12.7,9.84 13.09,9.46 USB1.A6 v13.09,4.76 | USB1.B6 14.09,5.76 14.61,5.24 v14.61,4.76
  Top 0.61: C4.2 R4.1
  Bottom 0.305: J2.P20 23.5,1.91 23.02,1.43 22.38,1.43 19.05,4.76 v14.61,4.76 14.13,4.76 13.57,4.21 13.26,4.21 13.09,4.38 v13.09,4.76
DTR
  Top 0.254: U2.18 13.34,17.94 13.97,18.57 16.63,18.57 16.83,18.38 16.83,18.22 16.95,18.1 17.18,18.1 17.3,18.22 17.3,18.89 17.46,19.05 17.62,19.05 17.78,18.89 17.78,18.26 17.94,18.1 18.1,18.1 18.26,18.26 18.26,19.84 18.41,20 18.57,20 18.73,19.84 18.73,18.1 18.89,17.94 19.21,17.94 19.37,18.1 Q1.E
  Top 0.61: R10.1 | Q1.E R10.1
EN  (via drill 0.5)
  Top 0.406: Q2.C 17.73,24.5 17.14,25.08 15.56,25.08 13.65,23.18 v8.57,23.18 | R1.1 C1.2 | C1.2 5.08,6.51 4.96,6.39 SW1.3 4.96,4.64 4.29,3.97 v4.29,3.49 | C1.2 4.42,7.17 4.13,7.46 v4.13,7.62 | SW1.4 5.95,1.34 v6.03,1.43
  Top 0.61: U1.3 v6.35,41.77
  Bottom 0.406: J1.P2 1.91,47.31 3.49,45.72 3.49,44.13 5.85,41.77 v6.35,41.77 6.8,41.77 6.99,41.59 7.3,41.27 7.3,34.61 10.16,31.75 10.16,25.72 8.57,24.13 v8.57,23.18 8.26,23.18 7.94,22.86 7.94,21.91 7.3,21.27 7.3,19.68 6.67,19.05 6.67,14.29 6.03,13.65 6.03,12.06 4.13,10.16 v4.13,7.62 | v6.03,1.43 6.03,2.22 6.35,2.54 6.35,3.49 5.71,4.13 4.92,4.13 v4.29,3.49
GND  (via drill 0.5)
  Top 0.254: U2.13 U2.21 U2.3 10.48,15.24 10.16,15.56 10.16,16.51 10,16.67 v9.53,16.67
  Top 0.305: 23.18,44.45 23.18,48.58 v23.5,48.9 23.18,49.21 23.18,50.16 | 23.18,44.45 23.18,44.13 v23.5,43.81 23.18,43.5 23.18,41.59 v23.5,41.27 23.18,40.96 23.18,39.05 v23.5,38.73 23.18,38.42 23.18,36.51 v23.5,36.2 23.18,35.88 23.18,33.97 v23.5,33.66 23.18,33.34 23.18,31.43 v23.5,31.11 23.18,30.8 23.18,28.89 v23.5,28.57 23.18,28.26 23.18,26.35 v23.5,26.04 23.18,25.72 23.18,23.81 v23.5,23.5 23.18,23.18 23.18,21.27 v23.5,20.95 23.18,20.64 23.18,18.73 v23.5,18.41 | 23.18,44.31 23.18,44.45 | v3.17,31.11 3.49,31.43 3.49,33.34 v3.17,33.66 3.49,33.97 3.49,35.88 v3.17,36.2 3.49,36.51 3.49,38.42 v3.17,38.73 3.49,39.05 3.49,40.96 v3.17,41.27 3.49,41.59 3.49,44.13 3.67,44.31 U1.1 | 3.49,14.13 3.49,15.56 v3.17,15.88 3.49,16.19 3.49,20.8 | 3.49,14.13 3.49,13.65 v3.17,13.34 3.49,13.02 3.49,8.41 | 23.18,50.16 23.18,51.12 v23.5,51.44 | 23.81,50.16 23.18,50.16 | v23.5,18.41 23.18,18.1 | v23.5,10.79 23.18,10.48 23.18,8.89 | 23.18,8.89 23.18,8.57 v23.5,8.26 23.18,7.94 23.18,6.03 v23.5,5.71 23.18,5.4 23.18,3.49 v23.5,3.17 23.18,2.86 23.18,0.95 v23.5,0.64 | 23.18,11.11 v23.5,10.79 | 23.18,11.11 23.18,12.7 23.5,13.02 v23.5,13.34 23.5,13.65 23.18,13.97 23.18,14.61 | 23.18,11.11 v23.5,10.79 | 23.18,18.1 v23.5,18.41 | R7.1 3.49,14.1 3.49,14.13 | 23.18,14.61 23.18,15.24 23.5,15.56 v23.5,15.88 23.5,16.19 23.18,16.51 23.18,16.67 | R9.1 23.18,14.74 23.18,14.61 | C8.1 19,14.92 | 23.18,16.67 20.16,16.67 19.37,15.88 19.05,15.88 | 23.18,18.1 23.18,16.67 | C9.1 19,14.92 | C2.1 21.59,8.57 21.91,8.89 23.18,8.89 | 19.05,15.88 18.1,15.88 16.83,17.14 v16.19,17.14 | 19,14.92 19,15.82 19.05,15.88 | 3.49,20.8 3.49,21.91
  Top 0.305: 3.49,21.91 3.49,23.5 | 3.49,30.8 v3.17,31.11 | C12.1 3.49,21.91 | v10.16,20.8 3.49,20.8 | U3.1 6.11,24.21 6.03,24.13 5.9,24 C13.1 3.49,23.5 | 3.49,23.5 3.49,30.8 | 3.49,30.8 v3.17,31.11 | U1.40 23.18,44.31 | 23.18,44.31 23.18,44.45 | v19.37,33.02 15.88,33.02 15.56,33.34 v13.65,33.34 | U1.1.4 U1.1.5 | U1.1.5 U1.1.6 | U1.1.6 U1.1.5 | U1.1.18 U1.1.6 | v11.75,33.34 v7.3,33.34 | C1.1 5.08,8.1 4.76,8.41 3.49,8.41 | 3.49,8.41 3.33,8.26 3.33,5.87 v3.17,5.71 3.49,5.4 3.49,3.49 v3.17,3.17
  Top 0.406: 19.05,11.91 19.05,11.75 TZ1.1 | C3.1 8.89,13.34 8.26,13.97 8.26,15.24 7.94,15.56 C10.1 8.78,16.56 8.89,16.67 v9.53,16.67 | SW2.2 19.56,2.86 | 19.56,2.86 SW2.1 | USB1.S4 17.68,2.86 19.56,2.86 | SW1.1 7.11,4.09 v6.99,3.97
  Top 0.61: C5.1 R6.1 C6.1 18.39,11.56 18.57,11.75 | 18.57,11.75 19.05,11.75 19.05,11.91 19.05,12.38 19,12.44 C8.1 | C7.1 19.71,11.56 19.53,11.75 18.57,11.75 | C3.1 R3.1 C4.1 | USB1.A1B12 9.43,8.01 9.02,7.59 USB1.S1 9.02,6.47 8.18,5.64 SW1.1 | USB1.S4 USB1.S2 17.66,7.59 17.24,8.01 USB1.B1A12 | v13.81,14.76 v13.81,15.72 v12.86,15.72 v12.86,14.76 13.34,14.76 U2.21 | USB1.S3 9.02,1.71 8.64,1.34 SW1.2 | C11.1 v9.53,16.67 | U1.1 5.89,44.31 6.03,44.45 v6.99,44.45 | U1.40 21.09,44.31 20.95,44.45 v20.32,44.45
  Top 0.813: J2.P1 23.81,50.16 | U1.1.11 11.84,39.28 11.75,39.37 v11.75,39.69 | U1.1.11 U1.1.1 U1.1.4 | U1.1.11 U1.1.3 U1.1.6 | U1.1.6 U1.1.18 10.48,35.19 10.48,35.24 | U1.1.4 U1.1.7 | U1.1.4 U1.1.5 | U1.1.5 U1.1.6 | U1.1.11 U1.1.5 | U1.1.5 U1.1.8 11.84,34.06 11.75,33.97 v11.75,33.34
  Bottom 0.305: v6.99,44.45 v7.94,44.45 v8.89,44.45 v9.84,44.45 v10.79,44.45 v11.75,44.45 v12.7,44.45 | v12.7,44.45 v13.65,44.45 v14.61,44.45 v15.56,44.45 v16.51,44.45 v17.46,44.45 v18.41,44.45 v19.37,44.45 v20.32,44.45 | v12.7,41.59 v12.7,40.64 | v12.7,42.55 v12.7,41.59 | v12.7,42.55 v12.7,43.5 | v12.7,43.5 v12.7,44.45 | v12.7,43.5 v11.75,43.5 CB2.1 | v12.7,43.5 v13.65,43.5 v14.61,43.5 v15.56,43.5 v16.51,43.5 v17.46,43.5 v18.41,43.5 v19.37,43.5 | CB1.1 12.7,41.91 v12.7,41.59 | v12.7,40.64 v11.75,40.64 v10.79,40.64 v9.84,40.64 | v12.7,40.64 v13.65,40.64 v14.61,40.64 v15.56,40.64 v16.51,40.64 v17.46,40.64 | v12.7,41.59 v13.65,41.59 v14.61,41.59 v15.56,41.59 v16.51,41.59 v17.46,41.59 v18.41,41.59 | v12.7,42.55 v13.65,42.55 v14.61,42.55 v15.56,42.55 v16.51,42.55 v17.46,42.55 v18.41,42.55 v19.37,42.55 | 7.93,2.13 7.93,1.27 v9.84,1.27 v10.79,1.27 v11.75,1.27 | v11.75,1.27 v12.7,1.27 | v12.7,1.27 v13.97,1.27 | v13.97,1.27 v14.92,1.27 | v14.92,1.27 v15.88,1.27 v16.83,1.27 18.64,1.27 JB1.G1 | v11.75,1.27 v11.75,2.22 v11.75,3.17 | v12.7,1.27 v12.7,2.22 v12.7,3.17 | v13.97,1.27 v13.97,2.22 v13.97,3.17 | v14.92,1.27 v14.92,2.22 v14.92,3.17 | v15.56,39.69 v15.56,38.73 v15.56,37.78 v15.56,36.83 v15.56,35.88 v15.56,34.92 | v19.37,33.02 v19.37,32.07 | v19.37,32.07 v19.37,31.11 | v19.37,32.07 v18.41,32.07 v18.41,31.11 | v18.41,31.11 v18.41,30.16 | v17.46,31.11 v18.41,31.11 | U1.1.5 U1.1.6 U1.1.18 | v13.65,33.34 v12.7,33.34 v11.75,33.34 | v7.3,32.38 v7.3,33.34 | v3.17,0.64 8.04,0.64 JB1.G2 | v12.7,40.64 v12.7,39.69 | v12.7,39.69 v11.75,39.69 v10.79,39.69 v9.84,39.69 | v12.7,39.69 v13.65,39.69 v14.61,39.69 | v15.56,39.69 v14.61,39.69
  Bottom 0.305: v16.51,39.69 v15.56,39.69 | v14.61,39.69 v14.61,38.73 v14.61,37.78 v14.61,36.83 v14.61,35.88 v14.61,34.92 v14.61,33.97
  Bottom 0.406: v23.5,0.64 22.23,0.64 20.63,2.23 JB1.G1 | v13.65,19.68 13.65,17.46 13.34,17.14 U2.21 v12.86,14.76 | 7.93,2.83 7.93,3.34 7.3,3.97 v6.99,3.97 | v9.53,16.67 9.53,16.83 9.21,17.14 9.21,19.37 10.16,20.32 v10.16,20.8
  Bottom 0.61: 17.66,7.59 USB1.S2 18.64,7.01 JB1.G3 18.41,7.53 18.41,8.57 16.34,8.57 16.34,8.91 | 7.93,2.83 USB1.S3 9.02,2.23 JB1.G2 7.93,2.13 | JB1.G1 18.64,2.83 USB1.S4 | JB1.G4 9.02,7.53 USB1.S1
  Bottom 0.813: U1.1.8 11.84,34.06 11.75,33.97 v11.75,33.34 | U1.1.8 U1.1.18 U1.1.6 | U1.1.8 U1.1.7 U1.1.4 | U1.1.4 U1.1.1 U1.1.11 | U1.1.11 U1.1.3 U1.1.6 | U1.1.8 U1.1.5 | U1.1.5 U1.1.11 | U1.1.4 U1.1.5 | U1.1.5 U1.1.6
  Bottom 1.016: JB1.1 16.34,8.91
  pour Top: 0,0 26.67,0 26.67,52.07 23.5,52.07 23.5,44.77 3.17,44.77 3.17,52.07 0,52.07
  pour Bottom: 0,0 26.67,0 26.67,52.07 23.5,52.07 23.5,44.77 3.17,44.77 3.17,52.07 0,52.07
IO0  (via drill 0.5)
  Top 0.406: R2.1 v20.64,7.17 | v20.64,7.17 20.64,6.03 21.03,5.64 SW2.4 SW2.3 | C2.2 v20.64,7.17 | v18.1,17.14 19.37,17.14 19.64,17.41 Q1.C | Q1.C 20.27,17.41 Q1.C | Q1.C 22.18,17.41 22.54,17.78 v22.54,18.41
  Top 0.61: U1.27 20.3,27.8 19.37,28.73 v19.37,29.53
  Bottom 0.406: J2.P14 23.5,17.14 22.54,18.1 v22.54,18.41 22.54,19.68 21.91,20.32 21.91,21.91 21.27,22.54 21.27,24.13 20.64,24.77 20.64,26.35 19.37,27.62 v19.37,29.53 | v20.64,7.17 20.64,10.79 19.68,11.75 19.68,13.65 19.05,14.29 19.05,15.88 18.1,16.83 v18.1,17.14
IO1  (via drill 0.5)
  Top 0.61: U1.39 v20.32,43.04
  Bottom 0.406: J2.P2 24.77,47.31 21.91,44.45 21.91,43.18 21.27,42.55 20.64,42.55 20.32,42.86 v20.32,43.04
IO2  (via drill 0.5)
  Top 0.61: U1.38 v20.32,41.77
  Bottom 0.406: JB1.4 10.34,12.21 9.84,12.7 9.84,13.97 10.48,14.61 10.48,16.83 9.84,17.46 9.84,19.05 12.06,21.27 12.06,30.16 16.83,34.92 16.83,38.73 19.86,41.77 v20.32,41.77 21.69,41.77 22.54,42.62 22.54,44.13 23.5,45.09 J2.P3
IO3  (via drill 0.5)
  Top 0.61: U1.15 v6.35,27.94
  Bottom 0.406: v6.35,27.94 6.35,26.67 4.76,25.08 4.76,23.5 4.13,22.86 4.13,21.27 3.49,20.64 3.49,19.05 1.91,17.46 J1.P14
IO4  (via drill 0.5)
  Top 0.61: U1.4 v6.35,40.5
  Bottom 0.406: J1.P3 1.91,44.77 6.17,40.5 v6.35,40.5
IO5  (via drill 0.5)
  Top 0.61: U1.5 v6.03,39.23
  Bottom 0.406: J1.P4 3.17,42.55 5.4,40.32 5.4,39.69 5.85,39.23 v6.03,39.23
IO6  (via drill 0.5)
  Top 0.61: U1.6 v6.03,37.96
  Bottom 0.406: v6.03,37.96 5.22,37.96 3.17,40.01 J1.P5
IO7  (via drill 0.5)
  Top 0.61: U1.7 v6.03,36.69
  Bottom 0.406: v6.03,36.69 3.95,36.69 3.17,37.47 J1.P6
IO8  (via drill 0.5)
  Top 0.61: U1.12 v6.03,30.34
  Bottom 0.406: v6.03,30.34 5.58,30.34 3.49,28.26 3.49,26.67 1.91,25.08 J1.P11
IO9  (via drill 0.5)
  Top 0.61: U1.17 8.89,27.62 7.94,28.57 v7.3,28.57
  Bottom 0.406: J1.P15 3.17,14.61 4.13,15.56 4.13,20.32 4.76,20.95 4.76,22.54 5.4,23.18 5.4,24.77 7.62,26.99 7.62,28.26 v7.3,28.57
IO10  (via drill 0.5)
  Top 0.61: U1.18 10.16,27.62 8.26,29.53 v7.62,29.53
  Bottom 0.406: J1.P16 3.17,12.06 4.13,13.02 4.13,14.61 4.76,15.24 4.76,20 5.4,20.64 5.4,22.23 6.03,22.86 6.03,24.45 8.26,26.67 8.26,28.89 v7.62,29.53
IO11  (via drill 0.5)
  Top 0.61: U1.19 11.43,27.62 8.57,30.48 v7.94,30.48
  Bottom 0.406: J1.P17 1.91,9.84 4.76,12.7 4.76,14.29 5.4,14.92 5.4,19.68 6.03,20.32 6.03,21.91 6.67,22.54 6.67,24.13 8.89,26.35 8.89,30.16 8.57,30.48 v7.94,30.48
IO12  (via drill 0.5)
  Top 0.61: U1.20 12.7,27.62 8.89,31.43 v8.26,31.43
  Bottom 0.406: J1.P18 1.91,7.3 3.49,8.89 3.49,10.48 5.4,12.38 5.4,13.97 6.03,14.61 6.03,19.37 6.67,20 6.67,21.59 7.3,22.23 7.3,23.81 9.53,26.04 9.53,30.8 8.89,31.43 v8.26,31.43
IO13  (via drill 0.5)
  Top 0.61: U1.21 13.97,28.26 15.56,29.84 v16.03,29.84
  Bottom 0.406: J2.P19 23.5,4.45 22.54,5.4 22.54,6.99 21.91,7.62 21.91,9.21 21.27,9.84 21.27,11.11 20.32,12.06 20.32,13.97 19.68,14.61 19.68,16.19 19.05,16.83 19.05,18.41 18.73,18.73 18.73,20.32 18.1,20.95 18.1,22.54 17.46,23.18 17.46,24.77 14.61,27.62 14.61,28.89 15.56,29.84 v16.03,29.84
IO14  (via drill 0.5)
  Top 0.61: U1.22 15.24,27.94 v15.56,28.26
  Bottom 0.406: J2.P18 23.5,6.99 22.54,7.94 22.54,9.53 21.91,10.16 21.91,11.43 20.95,12.38 20.95,14.29 20.32,14.92 20.32,16.51 19.68,17.14 19.68,18.73 19.37,19.05 19.37,20.64 18.73,21.27 18.73,22.86 18.1,23.5 18.1,25.08 15.56,27.62 v15.56,28.26
IO15  (via drill 0.5)
  Top 0.61: U1.8 v6.03,35.42
  Bottom 0.406: v6.03,35.42 3.67,35.42 3.17,34.92 J1.P7
IO16  (via drill 0.5)
  Top 0.61: U1.9 v6.03,34.15
  Bottom 0.406: v6.03,34.15 4.94,34.15 3.17,32.38 J1.P8
IO17  (via drill 0.5)
  Top 0.61: U1.10 v6.03,32.88
  Bottom 0.406: v6.03,32.88 6.03,32.7 3.17,29.84 J1.P9
IO18  (via drill 0.5)
  Top 0.61: U1.11 v6.35,31.61
  Bottom 0.406: v6.35,31.61 5.89,31.61 1.91,27.62 J1.P10
IO19  (via drill 0.5)
  Top 0.61: U1.13 v5.87,29.07
  Bottom 0.406: v5.87,29.07 5.26,29.07 4.13,27.94 4.13,26.35 3.49,25.72 3.49,24.13 1.91,22.54 J1.P12
IO20  (via drill 0.5)
  Top 0.61: U1.14 4.58,27.16 v5.08,26.67
  Bottom 0.406: v5.08,26.67 5.08,26.35 4.13,25.4 4.13,23.81 3.49,23.18 3.49,21.59 1.91,20 J1.P13
IO21  (via drill 0.5)
  Top 0.61: U1.23 v16.51,28.89
  Bottom 0.406: J2.P17 23.5,9.53 22.54,10.48 22.54,11.75 21.59,12.7 21.59,14.61 20.95,15.24 20.95,16.83 20.32,17.46 20.32,19.05 20,19.37 20,20.95 19.37,21.59 19.37,23.18 18.73,23.81 18.73,25.4 16.51,27.62 v16.51,28.89
IO35  (via drill 0.5)
  Top 0.61: U1.28 v20.32,29.07
  Bottom 0.406: J2.P13 23.5,19.68 22.54,20.64 22.54,22.23 21.91,22.86 21.91,24.45 21.27,25.08 21.27,26.67 20.32,27.62 v20.32,29.07
IO36  (via drill 0.5)
  Top 0.61: U1.29 v20,30.34
  Bottom 0.406: J2.P12 23.5,22.23 22.54,23.18 22.54,24.77 21.91,25.4 21.91,26.99 21.27,27.62 21.27,29.21 20.14,30.34 v20,30.34
IO37  (via drill 0.5)
  Top 0.61: U1.30 v20.32,31.61
  Bottom 0.406: J2.P11 23.5,24.77 22.54,25.72 22.54,27.3 21.91,27.94 21.91,29.53 21.27,30.16 21.27,31.11 20.77,31.61 v20.32,31.61
IO38  (via drill 0.5)
  Top 0.61: U1.31 v20.32,32.88
  Bottom 0.406: J2.P10 23.5,27.3 22.54,28.26 22.54,29.84 21.91,30.48 21.91,32.07 21.09,32.88 v20.32,32.88
IO39  (via drill 0.5)
  Top 0.61: U1.32 v20.32,34.15
  Bottom 0.406: J2.P9 23.5,29.84 22.54,30.8 22.54,32.38 20.77,34.15 v20.32,34.15
IO40  (via drill 0.5)
  Top 0.61: U1.33 v20.32,35.42
  Bottom 0.406: J2.P8 23.5,32.38 20.46,35.42 v20.32,35.42
IO41  (via drill 0.5)
  Top 0.61: U1.34 v20.32,36.69
  Bottom 0.406: v20.32,36.69 20.46,36.69 22.23,34.92 J2.P7
IO42  (via drill 0.5)
  Top 0.61: v17.78,37.96 v20.32,37.96 U1.35
  Bottom 0.406: v20.32,37.96 20.93,37.96 21.11,37.78 21.11,36.99 21.27,36.83 21.59,36.83 21.75,36.99 21.75,37.9 21.95,38.1 22.86,38.1 23.5,37.47 J2.P6 | JB1.3 12.34,11.95 12.06,12.22 11.75,12.22 11.59,12.06 11.59,11.91 11.43,11.75 11.11,11.75 10.95,11.91 10.95,12.54 10.48,13.02 10.48,13.65 11.11,14.29 11.11,17.14 10.48,17.78 10.48,18.73 12.7,20.95 12.7,29.84 18.02,35.16 18.02,35.72 17.86,35.88 17.62,35.88 17.46,36.04 17.46,36.35 17.62,36.51 17.94,36.51 18.1,36.67 18.1,36.99 17.78,37.31 v17.78,37.96
IO45
  Top 0.406: U1.26 21.39,26.55 22.23,25.72 J4.P$1
IO46
  Top 0.406: U1.16 7.62,25.4 6.99,24.77 J3.P$1
IO47  (via drill 0.5)
  Top 0.406: v22.54,13.34 22.09,13.34 R9.2
  Top 0.61: U1.24 17.78,27.62 17.46,27.94 v17.46,29.53
  Bottom 0.406: v17.46,29.53 17.46,27.62 19.37,25.72 19.37,24.13 20,23.5 20,21.91 20.64,21.27 20.64,19.68 20.95,19.37 20.95,17.78 21.59,17.14 21.59,15.56 22.54,14.61 v22.54,13.34 22.54,13.02 23.5,12.06 J2.P16
IO48  (via drill 0.5)
  Top 0.406: v22.54,15.88 20.95,15.88 20.32,15.24 R8.1
  Top 0.61: U1.25 19.05,27.62 18.41,28.26 v18.41,28.89
  Bottom 0.406: 22.54,16.51 22.54,17.14 21.59,18.1 21.59,19.68 21.27,20 21.27,21.59 20.64,22.23 20.64,23.81 20,24.45 20,26.04 18.41,27.62 v18.41,28.89 | 22.54,16.51 v22.54,15.88 | v22.54,15.88 22.54,16.51 | v22.54,15.88 22.54,15.56 23.5,14.61 J2.P15
N$1
  Top 0.254: U2.8 13.34,12.2 R4.2
N$2
  Top 0.254: U2.9 13.84,12.76 14.21,12.38 14.21,12.22 13.97,11.99 R5.2
N$3
  Top 0.61: C11.2 9.53,19.61
  Top 0.813: 7.94,18.73 C10.2
  Top 1.016: U3.3 9.53,19.61 7.94,19.61 | 7.94,19.61 F1.2 | 7.94,19.61 7.94,18.73
N$4
  Top 0.61: LED1.1 R7.2
N$5
  Top 0.61: LED2.1 21.48,11.86 20.32,13.02 R8.2
N$6
  Top 0.61: R10.2 Q2.B
N$7
  Top 0.61: R11.2 Q1.B
RTS
  Top 0.254: Q2.E 21.27,23.18 20.95,23.5 18.73,23.5 18.41,23.18 18.41,20.64 16.83,19.05 13.81,19.05 12.84,18.07 U2.19
  Top 0.61: R11.1 Q2.E
RXD  (via drill 0.5)
  Top 0.254: U2.17 13.84,17.8 14.13,18.1 14.92,18.1 15.24,17.78 v15.24,17.46
  Top 0.61: U1.36 v20.32,39.23
  Bottom 0.406: J2.P5 23.1,40.01 22.54,39.45 22.54,39.05 22.38,38.89 21.61,38.89 21.27,39.23 v20.32,39.23 19.71,39.23 19.37,38.89 19.37,34.61 13.97,29.21 13.97,20.95 14.61,20.32 15.56,20.32 15.88,20 15.88,19.53 15.72,19.37 15.4,19.37 15.24,19.21 v15.24,17.46
TXD  (via drill 0.5)
  Top 0.254: U2.1 11.31,16.47 11.11,16.67 11.11,16.83 11.27,16.99 11.59,16.99 11.75,17.14 11.75,17.3 11.43,17.62 v11.43,18.1
  Top 0.61: U1.37 v20.32,40.5
  Bottom 0.406: J2.P4 23.5,42.55 21.45,40.5 v20.32,40.5 19.55,40.5 18.73,39.69 18.73,34.92 13.34,29.53 13.34,20.64 11.43,18.73 v11.43,18.1
V_USB  (via drill 0.6, 0.8)
  Top 0.254: U2.12 16.33,14.74 v16.51,14.92
  Top 0.61: USB1.B4A9 15.79,8.8 16.19,9.21 17.14,9.21 v17.78,9.84 C6.2 | USB1.A4B9 10.88,8.8 10.48,9.21 10.16,9.21 9.53,9.84 v8.89,9.84 C3.2 | C9.2 v16.51,14.92 | 6.67,9.84 D1.2 | v11.43,13.34 10.16,13.34 9.21,14.29 v9.21,15.56 | v6.03,6.19 6.03,4.45 5.4,3.81 v5.4,3.17
  Top 0.813: 6.67,9.84 v8.89,9.84
  Bottom 0.61: v9.21,15.56 9.21,14.61 8.89,14.29 v8.89,9.84 7.46,9.84 6.83,9.21 6.83,7.3 6.03,6.51 v6.03,6.19 | v11.43,13.34 12.06,13.34 13.34,12.06 17.78,12.06 | v5.4,3.17 4.45,2.22 JB2.P$1
  Bottom 1.016: v16.51,14.92 16.51,14.13 17.78,12.86 17.78,12.06 v17.78,9.84

### Text on the board
tNames: LAMLOEI | NODE32S3 | FT231XQ | 46 | 45 | 19 | 20 | 36 | 35 | 3 | 0 | 9 | 48 | 47 | 11 | P | 48 | 21 | 12 | 5V | 14 | 13 | D- | D+ | E | B
bNames: 3V3 | EN | GND | 1 | 4 | 2 | 5 | 43TXD | 6 | 44RXD | 7 | 42 | 15 | 41 | 16 | 17 | 40 | 39 | 18 | 8 | 38 | 37 | 19 | 20 | 36 | 35 | 3 | NODE32S3 | LAMLOEI | 9 | 0 | 48 | 10 | SCL | SDA | 5V | GND | 47 | 11 | 21 | 12 | 14 | 5V | D | 13 | D+
tDocu: U1 | ESP32-S3-WROOM | J1 | J3 | J4 | J2 | C13 | 100n | Q2 | C12 | U3 | 22u | LM1117MPX | R10 | R11 | 12K | 12K | C10 | C11 | Q1 | F1 | 100n | 22u | FT231XQ | U2 | C9 | R8 | R9 | R7 | 100n | 2K2 | 12K | 2K2 | C8 | 22u | LED1 | TZ1 | LED2 | D1 | C3 | R3 | C4 | R4 | R5 | C5 | R6 | C6 | C7 | BLU | 100n | 5K1 | 47p | 27 | 27 | 47p | 5K1 | 100n | 100n | YEL | C1 | R1 | R2 | C2 | 1u | 12K | 12K | 100n | USB1 | SW1 | SW2
bDocu: 100n | CB2 | 22u | CB1 | JB1 | JB2